# EasyEDA Pro project ProPrj_Desktop_Pet_Dog_V1.3.epro, board PCB
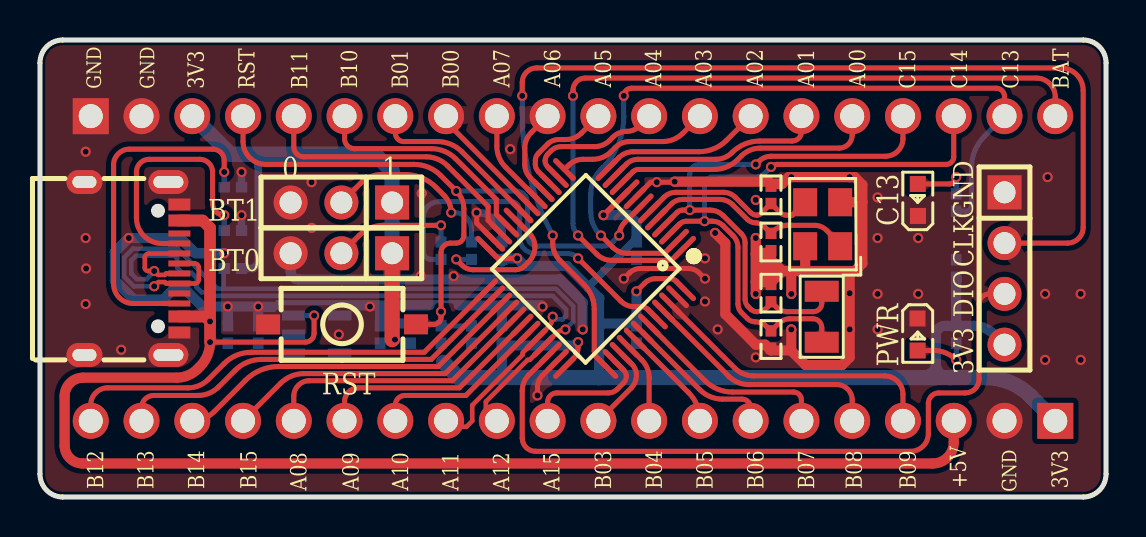
[diagram p3: board, top side]
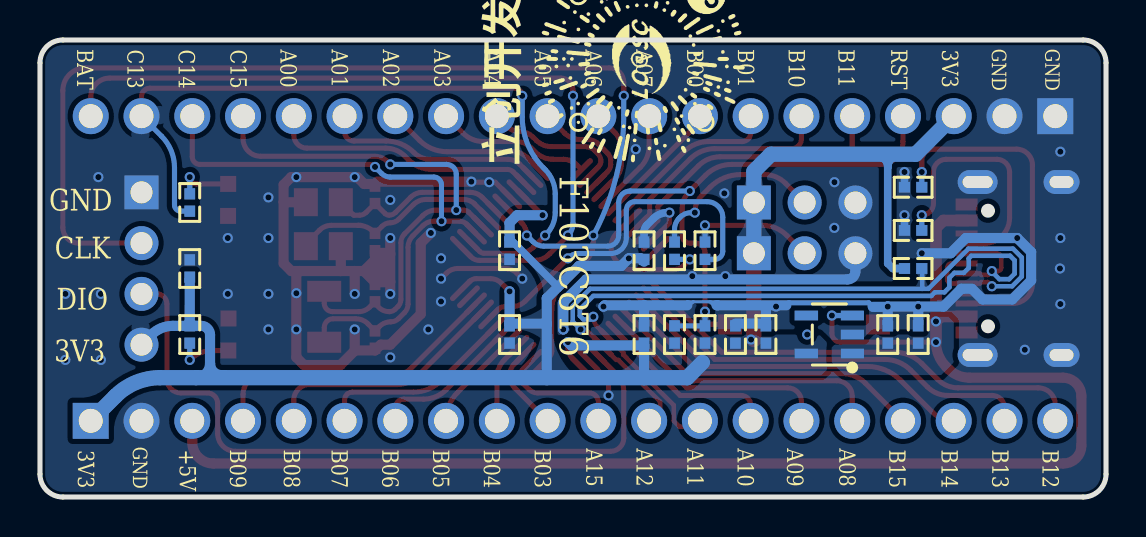
[diagram p4: board, bottom side, seen from below]

Outline 53.34 x 22.86 mm; copper layers: Top Layer, Bottom Layer. Coordinates in mm from the lower left corner of the outline.
Outline path: 0,21.72 0,1.14 arc(0.33,0.33) 1.14,0 52.2,0 arc(53.01,0.33) 53.34,1.14 53.34,21.72 arc(53.01,22.53) 52.2,22.86 1.14,22.86 arc(0.33,22.53) 0,21.72
Stack: Top Layer 0.035mm - / Dielectric1 1.51mm FR4 er 4.5 / Bottom Layer 0.035mm -

## Design rules (mm)
net USB_D-_PA11: DP1
net USB_D+_PA12: DP1
template: 自定义配置
spacing copperThickness1oz (default): track to track 0.102, other pairs 0.152 to 0.3
spacing copperThickness2oz: track to track 0.203, other pairs 0.152 to 0.3
track width copperThickness1oz (default): min 0.152, default 0.254, max 2.54
track width copperThickness2oz: min 0.152, default 0.254, max 2.54
differential pair differentialPair (default): width min 0.229, default 0.229, max 0.229; gap min 0.127, default 0.127
via viaSize (default): diameter min 0.508, default 0.508, max 0.508; hole min 0.305, default 0.305, max 0.305

## Placement (name value [footprint] x y rotation side)
C15  100nF  [R0402]  10.92 8.13 270 bottom
C16  100nF  [R0402]  17.02 8.13 270 bottom
C17  100nF  [R0402]  21.59 8.13 90 bottom
C18  100nF  [R0402]  23.11 8.13 270 bottom
C19  100nF  [R0402]  23.11 12.32 270 bottom
C20  100nF  [R0402]  29.84 12.32 90 bottom
C21  100nF  [R0402]  29.84 8.13 90 bottom
C22  100nF  [R0402]  45.85 11.43 270 bottom
C23  1uF  [R0402]  9.4 8.13 270 bottom
C24  1uF  [R0402]  18.54 8.13 270 bottom
C27  12pF  [R0402]  36.58 7.88 90 top
C28  12pF  [R0402]  36.58 10.2 270 top
C33  12pF  [R0402]  36.58 15.11 270 top
C34  12pF  [R0402]  36.58 12.75 270 top
H1  YZT1070-06104-04025-01  [HDR-TH_4P-P2.54-V-M]  48.26 11.43 270 top
H2  -  [HDR-TH_20P-P2.54-V-M-1]  26.67 19.05 0 top
H3  -  [HDR-TH_3P-P2.54-V-M]  15.08 12.19 180 top
H4  -  [HDR-TH_3P-P2.54-V-M]  15.08 14.73 180 top
H5  -  [HDR-TH_20P-P2.54-V-M-1]  26.67 3.81 180 top
LDO1  ME6211C33M5G-N  [SOT-23-5_L3.0-W1.7-P0.95-LS2.8-BL]  13.84 8.13 90 bottom
LED1  -  [LED_0603]  43.92 8.08 270 top
LED2  -  [LED_0603]  43.92 14.91 90 top
R9  5.1kΩ  [R0402]  9.65 15.49 0 bottom
R10  5.1kΩ  [R0402]  9.65 13.33 0 bottom
R11  1.5kΩ  [R0402]  9.65 11.43 0 bottom
R12  1kΩ  [R0402]  45.85 8.13 90 bottom
R13  1kΩ  [R0402]  45.85 14.73 270 bottom
R14  10kΩ  [R0402]  20.07 8.13 270 bottom
R15  10kΩ  [R0402]  21.59 12.32 90 bottom
R16  10kΩ  [R0402]  20.07 12.32 270 bottom
SW1  TS-1101-B-W  [KEY-SMD_2P-L6.0-W3.6-P7.4-LS8.0-L]  15.11 8.64 0 top
U1  STM32F103C8T6  [LQFP-48_L7.0-W7.0-P0.50-LS9.0-BL]  27.31 11.43 135 top
USB1  TYPE-C 16PIN 2MD(073)  [USB-C-SMD_TYPE-C-6PIN-2MD-073]  4.6 11.43 270 top
X3  8MHz  [CRYSTAL-SMD_4P-L3.2-W2.5-BL-1]  39.16 13.64 90 top
X5  32.768kHz  [OSC-SMD_L3.2-W1.5]  39.12 9.02 90 top

## Footprints (pads in the part's own frame, mm; a bottom-side part is the same pattern mirrored in y, then rotated)
CRYSTAL-SMD_4P-L3.2-W2.5-BL-1
  rect 1.4x1.2 smd: 1(-1.1,-0.875) 2(1.1,-0.875) 3(1.1,0.875) 4(-1.1,0.875)
HDR-TH_3P-P2.54-V-M
  rect 1.7x1.7 hole 1.1: 1(-2.54,0)
  round 1.7 hole 1.1: 2(0,0) 3(2.54,0)
HDR-TH_4P-P2.54-V-M
  rect 1.7x1.7 hole 1.1: 1(-3.81,0)
  round 1.7 hole 1.1: 2(-1.27,0) 3(1.27,0) 4(3.81,0)
HDR-TH_20P-P2.54-V-M-1
  rect 1.8x1.8 hole 1.2: 1(-24.13,0)
  round 1.8 hole 1.2: 2(-21.59,0) 3(-19.05,0) 4(-16.51,0) 5(-13.97,0) 6(-11.43,0) 7(-8.89,0) 8(-6.35,0) 9(-3.81,0) 10(-1.27,0) 11(1.27,0) 12(3.81,0) 13(6.35,0) 14(8.89,0) 15(11.43,0) 16(13.97,0) 17(16.51,0) 18(19.05,0) 19(21.59,0) 20(24.13,0)
KEY-SMD_2P-L6.0-W3.6-P7.4-LS8.0-L
  rect 1.2x1 smd: 1(-3.7,0) 2(3.7,0)
LED_0603
  rect 0.8x0.8 smd: 1(-0.851,-0.01) 2(0.75,-0.005)
LQFP-48_L7.0-W7.0-P0.50-LS9.0-BL
  oval 0.27x1.5 smd: 1(-2.75,-4.25) 2(-2.25,-4.25) 3(-1.75,-4.25) 4(-1.25,-4.25) 5(-0.75,-4.25) 6(-0.25,-4.25) 7(0.25,-4.25) 8(0.75,-4.25) 9(1.25,-4.25) 10(1.75,-4.25) 11(2.25,-4.25) 12(2.75,-4.25) 25(2.75,4.25) 26(2.25,4.25) 27(1.75,4.25) 28(1.25,4.25) 29(0.75,4.25) 30(0.25,4.25) 31(-0.25,4.25) 32(-0.75,4.25) 33(-1.25,4.25) 34(-1.75,4.25) 35(-2.25,4.25) 36(-2.75,4.25)
  oval 1.5x0.27 smd: 13(4.25,-2.75) 14(4.25,-2.25) 15(4.25,-1.75) 16(4.25,-1.25) 17(4.25,-0.75) 18(4.25,-0.25) 19(4.25,0.25) 20(4.25,0.75) 21(4.25,1.25) 22(4.25,1.75) 23(4.25,2.25) 24(4.25,2.75) 37(-4.25,2.75) 38(-4.25,2.25) 39(-4.25,1.75) 40(-4.25,1.25) 41(-4.25,0.75) 42(-4.25,0.25) 43(-4.25,-0.25) 44(-4.25,-0.75) 45(-4.25,-1.25) 46(-4.25,-1.75) 47(-4.25,-2.25) 48(-4.25,-2.75)
OSC-SMD_L3.2-W1.5
  rect 1.05x1.7 smd: 1(-1.275,0) 2(1.275,0)
R0402
  rect 0.566x0.54 smd: 1(-0.433,0) 2(0.433,0)
SOT-23-5_L3.0-W1.7-P0.95-LS2.8-BL
  rect 0.49x1.157 smd: 1(-0.95,-1.153) 2(0,-1.153) 3(0.95,-1.153)
  rect 0.49x1.175 smd: 4(0.95,1.153) 5(-0.95,1.153)
USB-C-SMD_TYPE-C-6PIN-2MD-073
  rect 0.6x1.1 smd: 1(-3.2,2.375) 2(-2.4,2.375) 11(2.4,2.375) 12(3.2,2.375)
  rect 0.3x1.1 smd: 3(-1.75,2.375) 4(-1.25,2.375) 5(-0.75,2.375) 6(-0.25,2.375) 7(0.25,2.375) 8(0.75,2.375) 9(1.25,2.375) 10(1.75,2.375)
  oval 1.2x2 hole 0.6x1.5: 13(-4.325,1.825) 14(4.325,1.825)
  oval 1.2x1.8 hole 0.6x1.2: 13(-4.325,-2.375) 14(4.325,-2.375)

## Nets
As in the schematic.

Pads without a net: LDO1 4; USB1 3 9

## Via types
v1: diameter 0.508, hole 0.305, Top Layer to Bottom Layer, 85 vias

## Routing (per net, layer and track width the routed paths; a pad name or vN(x,y) marks a point on that pad's centre or on a via; arc(x,y) is an arc through that point)
3V3: length 102.9
  Top Layer w0.254: U1.48 31.83,10.79 arc(31.69,10.89) 31.52,10.92 30.8,10.92 arc(30.5,10.86) 30.26,10.7 v1(29.84,10.29) ; v1(26.92,7.75) 26.92,7.48 arc(26.87,7.18) 26.7,6.94 U1.36 ; v1(23.88,11.94) 22.91,11.94 U1.24
  Top Layer w0.28: v1(28.19,14.1) 28.2,14.1 U1.9
  Top Layer w0.762: H3.1 17.62,7.87
  Bottom Layer w0.381: 27.43,10.5 27.43,10.52 29.78,12.86 29.84,12.86 ; 10.92,16.64 10.92,17.02 ; 10.92,16.64 10.92,16.51 ; 10.92,16.64 arc(10.81,16.91) 10.54,17.02 ; 10.92,16.51 10.92,11.68 10.67,11.43 10.09,11.43 ; 10.92,16.51 arc(10.77,16.87) 10.41,17.02 ; 10.92,16.51 arc(11.07,16.87) 11.43,17.02
  Bottom Layer w0.508: R12.2 45.28,8.56 arc(44.96,8.43) 44.83,8.11 44.83,6.67 ; R12.2 45.85,10.89 ; R12.2 46.7,8.56 arc(47.27,8.45) 47.76,8.12 H1.4 ; 44.83,6.67 44.83,6.1 ; 44.83,6.67 arc(44.66,6.26) 44.26,6.1 44.07,6.1 ; 44.83,6.67 arc(45.04,6.17) 45.53,5.97 ; 27.98,8.67 27.98,9.95 26.37,11.56 24.26,11.56 v1(23.88,11.94) 23.28,11.94 23.11,11.77 ; 27.98,8.67 27.99,8.67 29.84,8.67 v1(29.84,10.29) ; 27.98,8.67 27.98,5.97 ; v1(28.19,14.1) 29.46,14.1 29.84,13.72 29.84,12.86 ; 23.11,5.97 23.11,7.58 26.76,7.58 v1(26.92,7.75)
  Bottom Layer w0.762: 20.19,6.73 20.96,5.97 47.34,5.97 arc(48.54,5.73) 49.56,5.05 H5.1 ; H3.1 H4.1 17.62,16.29 16.76,17.14 9.53,17.14 H2.3
  vias: v1(17.76,7.87)
+5V: length 74.4
  Top Layer w0.254: v1(8.51,7.75) 13.27,7.75 arc(13.59,7.88) 13.72,8.19 v1(13.72,9.08)
  Top Layer w0.508: H5.3 45.72,2.73 arc(45.41,1.99) 44.67,1.68 2.13,1.68 arc(1.5,1.94) 1.23,2.58 1.23,5.04 arc(1.5,5.7) 2.16,5.97 6.84,5.97 arc(7.4,6.08) 7.88,6.4 8,6.52 arc(8.38,7.08) v1(8.51,7.75)
  Top Layer w0.584: USB1.2 8.14,13.83 8.51,13.46 v1(8.51,8.78) ; v1(8.51,8.78) v1(8.51,7.75) ; v1(8.51,8.78) 8.26,9.03 USB1.11
  Bottom Layer w0.254: LDO1.3 v1(13.72,9.08) 13.72,9.02
GND: length 115.3
  Top Layer w0.254: v1(21.85,14.22) 21.85,13.71 U1.23 ; v1(24.89,5.08) 24.89,5.49 arc(24.96,5.81) 25.14,6.08 25.89,6.83 ; U1.8 30.56,15.75 v1(30.86,15.75) 31.73,15.75 v1(31.76,15.77) ; v1(29.21,10.92) 29.48,11.2 arc(29.74,11.37) 30.05,11.43 32.45,11.43 arc(32.74,11.37) 32.99,11.2 v1(33.27,10.92)
  Top Layer w0.508: 38.3,11.3 40.36,11.3 ; 38.3,11.3 37.6,11.3 ; 38.3,11.3 arc(38.29,11.32) 38.29,11.34 X3.4 ; 40.36,11.3 40.77,11.3 41.15,11.68 41.15,14.75 ; 40.36,11.3 40.51,11.15 v1(40.51,10.19) v1(40.51,8.39) 40.51,6.98 40.13,6.6 38.3,6.6 37.58,7.33 ; 41.15,14.75 41.15,15.62 40.77,16 v1(40.51,16) 37.47,16 37.12,15.66 36.58,15.66 36.46,15.77 v1(31.76,15.77) ; 41.15,14.75 arc(41.14,14.75) 41.13,14.74 X3.2 ; 37.6,11.3 37.13,11.3 ; 37.6,11.3 37.59,11.3 v1(37.59,10.16) ; v1(35.81,10.16) 35.81,10.76 ; 35.81,10.76 35.81,12.15 ; 35.81,10.76 35.83,10.74 36.58,10.74 ; 37.58,7.33 37.59,7.35 v1(37.59,8.38) ; 37.58,7.33 36.58,7.33 36.29,7.62 35.82,7.62 34.29,9.15 34.29,12.7 v1(33.78,13.21) ; 36.58,11.86 36.58,10.74 ; 36.58,11.86 37.13,11.3 ; 36.58,11.86 36.58,12.21 ; 36.58,10.74 37.13,11.3 ; 36.58,12.21 36.48,12.21 ; 36.58,12.21 C34.2 arc(36.52,12.27) 36.48,12.21 ; 36.48,12.21 35.87,12.21 35.81,12.15 ; 36.48,12.21 arc(36.27,11.83) 36.19,11.4 36.19,11.05 ; 35.81,12.15 v1(35.81,12.95)
  Bottom Layer w0.152: 20.96,9.59 20.96,9.77 20.66,9.77 ; 19.82,9.77 19.43,9.77 19.43,9.59 ; 19.82,9.77 19.65,9.6 ; 19.82,9.77 20.66,9.77 ; 20.66,9.77 20.8,9.62 20.82,9.62
  Bottom Layer w0.254: 16,9.59 15.88,9.72 11.87,9.72 11.56,9.4
  Bottom Layer w0.381: 10.09,15.49 v1(10.09,16.26) ; 10.09,13.33 v1(10.09,14.1) ; 23.11,12.86 23.11,13.28 arc(23.08,13.45) 22.99,13.59 22.64,13.93 arc(22.32,14.15) 21.94,14.22 v1(21.85,14.22)
  Bottom Layer w0.508: 9.4,8.67 v1(9.4,9.53) ; v1(9.4,9.53) v1(10.92,9.53) ; v1(9.4,9.53) 8.13,9.53 7.24,10.41 6.71,10.41 6.18,9.88 4.69,9.88 3.75,10.83 3.75,12.26 v1(4.44,12.95) 7.01,12.95 7.78,12.19 v1(9.22,12.19) ; v1(10.92,9.53) 10.92,8.67 ; v1(10.92,9.53) 10.94,9.51 11.67,9.51 ; 23.11,8.67 23.11,9.58 23.11,9.59 ; 18.54,8.67 17.02,8.67 17.02,9.53 ; v1(25.15,9.53) 25.08,9.59 23.11,9.59 ; 16,9.59 19.49,9.59 ; 23.11,9.59 20.96,9.59 ; v1(27.16,8.38) 27.15,8.39 27.15,9.74 26.01,10.88 12.94,10.88 arc(12.66,11) 12.54,11.29 H3.3
  vias: v1(2.29,17.27) v1(2.29,12.95) v1(2.31,11.43) v1(2.29,9.65) v1(4.06,7.37) v1(13.59,15.75) v1(13.59,13.46) v1(14.95,8.13) v1(16.51,9.53) v1(19.1,15.19) v1(19.05,11.05) v1(20.7,11.05) v1(23.53,17.4) v1(33.27,11.94) v1(33.27,9.78) v1(33.91,8.38) v1(35.81,14.86) v1(35.81,6.98) v1(37.59,16) v1(41.91,14.99) v1(41.91,12.95) v1(41.91,10.16) v1(41.91,8.38) v1(43.94,12.95) v1(43.94,10.16) v1(50.29,10.16) v1(50.29,6.86) v1(50.42,16) v1(52.07,10.16) v1(52.07,6.86)
VBAT: length 39.4
  Top Layer w0.254: U1.1 31.77,12 arc(31.58,11.88) 31.36,11.84 28.61,11.84 arc(28.2,11.92) 27.86,12.15 v1(26.92,13.08) ; v1(26.67,20.07) 26.67,20.35 arc(26.85,20.78) 27.28,20.95 49.85,20.95 arc(50.52,20.68) 50.8,20.01 H2.20
  Bottom Layer w0.254: v1(26.67,20.07) 26.67,13.69 arc(26.74,13.36) v1(26.92,13.08)
BOOT0: length 18.3
  Top Layer w0.254: v1(26.92,11.94) 29.07,9.8 arc(29.37,9.6) 29.72,9.53 30.06,9.53 arc(30.26,9.49) 30.42,9.38 U1.44
  Bottom Layer w0.254: R16.2 19.58,11.89 arc(19.29,12) 19.18,12.29 19.18,13.99 arc(19.41,14.54) 19.96,14.77 23.58,14.77 arc(23.88,14.65) 24,14.35 24,12.95 arc(24.23,12.41) 24.78,12.18 26.4,12.18 arc(26.66,12.13) 26.88,11.98 v1(26.92,11.94)
BOOT1: length 7.3
  Top Layer w0.254: v1(20.83,11.89) 21.12,11.6 arc(21.37,11.43) 21.67,11.37 23.8,11.37 arc(24.04,11.42) 24.25,11.56 24.45,11.76 arc(24.68,12.11) 24.76,12.52 arc(24.69,12.88) 24.49,13.18 U1.20
  Bottom Layer w0.254: R15.1 v1(20.83,11.89)
NRST: length 36.6
  Top Layer w0.254: U1.7 29.25,13.73 arc(29.05,13.43) v1(28.98,13.08) ; H2.4 10.16,17.78 arc(10.49,16.97) 11.3,16.64 18.72,16.64 arc(19.44,16.49) 20.04,16.09 v1(20.83,15.31) 20.85,15.29 arc(21.11,14.89) 21.21,14.41 21.21,13.08 arc(21.1,12.81) 20.83,12.7 20.54,12.7 arc(20.2,12.56) 20.07,12.23 v1(20.07,9.27) 20.07,8.99 arc(19.96,8.74) 19.71,8.64 SW1.2
  Bottom Layer w0.254: 21.59,8.67 21.48,8.56 R14.1 v1(20.07,9.27) ; v1(28.98,13.08) 28.67,12.77 arc(28.42,12.6) 28.14,12.55 24.93,12.55 arc(24.54,12.71) 24.38,13.09 24.38,14.73 arc(24.22,15.14) 23.81,15.31 v1(20.83,15.31)
OSC32_IN: length 30.1
  Top Layer w0.254: H2.18 45.72,17.02 arc(45.61,16.75) 45.34,16.64 36.88,16.64 arc(36.72,16.6) v1(36.58,16.51) ; U1.3 32.01,13.66 arc(32.16,13.76) 32.34,13.79 v1(33.25,13.79) 33.63,13.79 arc(33.93,13.73) 34.19,13.56 34.68,13.07 arc(34.86,12.8) 34.93,12.48 34.93,9.65 arc(34.97,9.42) 35.1,9.22 35.4,8.92 arc(35.58,8.81) 35.79,8.76 arc(36.1,8.7) 36.36,8.53 36.58,8.31 36.93,8.66 arc(37.21,8.85) 37.54,8.92 38.68,8.92 arc(38.99,8.79) 39.12,8.48 X5.1
  Bottom Layer w0.254: v1(33.25,13.79) 33.25,15.62 arc(33.36,15.89) 33.63,16 35.8,16 arc(36.05,16.05) 36.25,16.19 v1(36.58,16.51)
OSC32_OUT: length 27.9
  Top Layer w0.254: H2.17 43.18,17.93 arc(42.92,17.3) 42.29,17.04 36.58,17.04 arc(36.25,16.98) 35.97,16.79 v1(35.81,16.64) ; X5.2 39.12,9.69 arc(38.99,9.39) 38.7,9.27 37.4,9.27 arc(37.1,9.33) 36.84,9.5 C28.2 arc(36.3,9.41) 35.86,9.27 arc(35.7,9.3) 35.56,9.39 35.43,9.53 arc(35.32,9.69) 35.28,9.88 35.28,12.73 arc(35.23,12.96) 35.1,13.16 34.18,14.08 arc(33.88,14.28) 33.52,14.35 v1(32.51,14.35) 32.15,14.35 arc(32.01,14.32) 31.88,14.24 U1.4
  Bottom Layer w0.254: v1(32.51,14.35) 32.51,16.15 arc(32.65,16.49) 33,16.64 v1(35.81,16.64)
OSC_IN: length 10.9
  Top Layer w0.254: U1.5 31.59,14.66 arc(31.84,14.83) 32.14,14.88 34.01,14.88 arc(34.37,14.81) 34.67,14.61 35.39,13.89 arc(35.58,13.76) 35.81,13.72 arc(36.03,13.67) 36.22,13.55 C34.1 36.66,13.27 arc(37.01,13.51) 37.42,13.59 ; 37.42,13.59 38.76,13.59 arc(39.08,13.52) 39.36,13.34 40.04,12.66 X3.1 ; 37.42,13.59 37.27,13.59
OSC_OUT: length 9.3
  Top Layer w0.254: X3.3 37.64,14.1 37.35,14.1 arc(37.17,14.13) 37.02,14.23 C33.2 36.08,14.18 arc(35.98,14.12) 35.88,14.1 arc(35.7,14.13) 35.55,14.23 34.79,14.99 arc(34.52,15.18) 34.19,15.24 31.82,15.24 arc(31.5,15.18) 31.22,14.99 30.49,14.26
PA0: length 13.5
  Top Layer w0.254: U1.10 29.67,16.27 arc(29.8,16.35) 29.95,16.38 33.71,16.38 arc(34.36,16.51) 34.92,16.88 35.09,17.06 arc(35.53,17.35) 36.04,17.45 39.98,17.45 arc(40.45,17.64) 40.64,18.11 H2.16
PA1: length 11
  Top Layer w0.254: U1.11 29.34,16.65 arc(29.61,16.83) 29.92,16.89 33.81,16.89 arc(34.25,16.98) 34.63,17.23 arc(35.27,17.66) 36.02,17.81 37.63,17.81 arc(37.96,17.94) 38.1,18.27 H2.15
PA2: length 8.2
  Top Layer w0.254: U1.12 28.95,16.97 arc(29.29,17.19) 29.69,17.27 32.98,17.27 arc(33.72,17.42) 34.35,17.84 H2.14
PA3: length 7.7
  Top Layer w0.254: U1.13 26.47,16.61 arc(26.79,16.82) 27.16,16.89 27.65,16.89 arc(28.15,16.99) 28.58,17.28 28.79,17.48 arc(29.12,17.7) 29.5,17.78 31.16,17.78 arc(31.71,17.89) 32.17,18.2 H2.13
PA4: length 7.1
  Top Layer w0.254: 25.89,16.03 25.39,16.52 arc(25.3,16.66) 25.27,16.81 arc(25.31,17) 25.42,17.16 25.57,17.31 arc(25.8,17.47) 26.08,17.53 27.74,17.53 arc(28.16,17.61) 28.51,17.84 28.67,18 arc(28.99,18.21) 29.36,18.29 arc(29.69,18.35) 29.97,18.54 H2.12
PA5: length 5.5
  Top Layer w0.254: H2.11 27.09,18.2 arc(26.74,17.97) 26.32,17.88 25.95,17.88 arc(25.69,17.84) 25.46,17.7 arc(25.43,17.68) 25.4,17.65 24.93,17.19 arc(24.82,17.02) 24.78,16.83 24.78,16.64 arc(24.82,16.44) 24.94,16.27 U1.15
PA6: length 4.5
  Top Layer w0.254: U1.16 24.53,15.98 arc(24.33,16.27) 24.26,16.63 24.26,17.45 arc(24.34,17.87) 24.58,18.23 H2.10
PA7: length 4.8
  Top Layer w0.254: H2.9 22.86,17.55 arc(22.97,16.98) 23.3,16.5 U1.17
PA8: length 14
  Top Layer w0.254: U1.29 20.63,5.82 13.47,5.82 arc(12.93,5.59) 12.7,5.04 H5.16
PA9/USART1_TX: length 11.5
  Top Layer w0.254: U1.30 20.98,5.46 15.93,5.46 arc(15.44,5.26) 15.24,4.77 H5.15
PA10/USART1_RX: length 9.1
  Top Layer w0.254: U1.31 21.31,5.08 18.26,5.08 arc(17.92,4.94) 17.78,4.6 H5.14
PA13/SWDIO: length 36
  Top Layer w0.254: H1.3 47.49,10.16 arc(47.14,10.01) 46.99,9.66 46.99,5.9 arc(46.79,5.41) 46.29,5.21 44.98,5.21 arc(44.6,5.05) 44.45,4.68 44.45,3.17 arc(44.19,2.55) 43.56,2.29 24.79,2.29 arc(24.32,2.48) 24.13,2.95 24.13,5.31 arc(24.22,5.74) 24.46,6.11 U1.34
PA14/SWCLK: length 55.8
  Top Layer w0.254: v1(24.13,20.07) 24.13,20.74 arc(24.34,21.25) 24.85,21.46 51.06,21.46 arc(51.87,21.13) 52.2,20.33 52.2,13.49 arc(51.97,12.93) 51.41,12.7 H1.2 ; v1(25.65,13.08) 25.65,12.7 arc(25.75,12.23) 26.01,11.83 27.23,10.62 arc(27.5,10.27) 27.67,9.86 arc(27.7,9.75) 27.72,9.64 arc(27.73,9.52) 27.73,9.4 27.73,7.3 arc(27.77,7.13) 27.86,6.98 U1.37
  Bottom Layer w0.254: v1(24.13,20.07) 24.13,19.1 arc(24.17,18.09) 24.29,17.08 arc(24.8,15.03) v1(25.65,13.08)
PA15: length 6.6
  Top Layer w0.254: U1.38 29.21,6.34 arc(29.31,6.2) 29.34,6.04 arc(29.3,5.86) 29.19,5.7 28.89,5.39 arc(28.68,5.26) 28.44,5.21 25.86,5.21 arc(25.54,5.07) 25.4,4.74 H5.11
PB0: length 6.1
  Top Layer w0.254: U1.18 20.52,18.57 arc(20.37,18.79) H2.8
PB1: length 8.8
  Top Layer w0.254: U1.19 21.11,17.27 arc(20.55,17.65) 19.88,17.78 18.2,17.78 arc(17.9,17.9) 17.78,18.2 H2.7
PB3: length 4.4
  Top Layer w0.254: U1.39 29.62,6.64 arc(29.79,6.39) 29.84,6.09 arc(29.78,5.74) 29.58,5.45 H5.10
PB4: length 4.1
  Top Layer w0.254: U1.40 30.11,6.86 arc(30.38,6.45) 30.48,5.96 H5.9
PB5: length 5.3
  Top Layer w0.254: H5.8 33.02,3.86 arc(32.87,4.59) 32.46,5.22 U1.41
PB6: length 7.6
  Top Layer w0.254: U1.42 33.01,5.37 arc(33.54,5.02) 34.16,4.89 35.13,4.89 arc(35.43,4.77) 35.56,4.47 H5.7
PB7: length 10.2
  Top Layer w0.254: H5.6 38.1,4.86 arc(37.98,5.14) 37.71,5.25 34.65,5.25 arc(33.9,5.4) 33.26,5.82 30.49,8.6
PB8: length 12.4
  Top Layer w0.254: H5.5 40.64,4.85 arc(40.41,5.4) 39.86,5.62 35.47,5.62 arc(34.92,5.73) 34.46,6.04 U1.45
PB9: length 14.9
  Top Layer w0.254: H5.4 43.18,5.13 arc(42.91,5.79) 42.25,6.06 35.72,6.06 arc(35.19,6.16) 34.75,6.46 U1.46
PB10: length 11.6
  Top Layer w0.254: U1.21 22.83,14.13 22.83,14.89 20.8,16.92 arc(20.24,17.29) 19.57,17.42 15.74,17.42 arc(15.39,17.57) 15.24,17.92 H2.6
PB11: length 14.1
  Top Layer w0.254: U1.22 22.42,13.84 22.42,14.53 20.38,16.57 arc(19.89,16.9) 19.31,17.02 13.19,17.02 arc(12.84,17.16) 12.7,17.51 H2.5
PB12: length 23
  Top Layer w0.254: H5.20 2.54,4.61 arc(2.79,5.21) 3.39,5.46 7.41,5.46 arc(7.96,5.57) 8.42,5.88 9.21,6.67 arc(9.84,7.09) 10.58,7.24 19.22,7.24 U1.25
PB13: length 20.5
  Top Layer w0.254: U1.26 19.58,6.88 11.08,6.88 arc(10.37,6.74) 9.77,6.34 8.93,5.5 arc(8.46,5.19) 7.91,5.08 5.69,5.08 arc(5.26,4.9) 5.08,4.47 H5.19
PB14: length 17.7
  Top Layer w0.254: U1.27 19.93,6.53 11.94,6.53 arc(11.05,6.35) 10.29,5.85 8.7,4.26 arc(8.21,3.93) H5.18
PB15: length 15.5
  Top Layer w0.254: U1.28 20.28,6.17 13.21,6.17 arc(12.57,6.05) 12.04,5.69 H5.17
PC13: length 38.5
  Top Layer w0.254: v1(28.07,13.08) 28.66,12.49 arc(28.99,12.27) 29.38,12.19 31.12,12.19 arc(31.24,12.22) 31.34,12.28 31.9,12.84 ; H2.19 48.26,20.04 arc(48.14,20.33) 47.85,20.45 29.59,20.45 arc(29.32,20.34) v1(29.21,20.07)
  Bottom Layer w0.254: 45.85,14.3 46.3,14.3 arc(46.52,14.39) 46.61,14.61 46.61,16.48 arc(46.78,17.33) 47.26,18.05 H2.19 ; v1(29.21,20.07) 29.21,19.01 arc(29.06,17.97) 28.6,17.02 arc(28.4,16.74) 28.16,16.47 28.07,16.38 arc(27.69,15.82) 27.56,15.16 27.56,14.23 arc(27.68,13.64) 28.01,13.13 v1(28.07,13.08)
USB_D+_PA12: length 39.6
  Top Layer w0.229: USB1.6 7.73,11.68 arc(7.89,11.62) 7.95,11.47 7.95,10.88 arc(7.89,10.74) 7.74,10.68 USB1.8 6.31,10.68 6.24,10.75 5.93,10.75 v1(5.72,10.54) ; H5.12 22.85,3.81 22.31,4.35 22.31,4.77 24.4,6.86 24.5,6.86 U1.33 25.84,8.19 arc(26.04,8.33) v1(26.29,8.38)
  Bottom Layer w0.229: v1(26.29,8.38) 26.68,8.78 26.68,9.55 25.81,10.41 9.2,10.41 ; 9.2,10.41 8.89,10.41 6.88,12.42 4.65,12.42 4.22,11.98 4.22,11.02 4.7,10.54 v1(5.72,10.54) ; 9.2,10.41 9.2,11.41 R11.1
USB_D-_PA11: length 39.4
  Top Layer w0.229: USB1.7 6.31,11.18 6.24,11.11 5.91,11.11 v1(5.72,11.3) 5.41,11.3 arc(5.29,11.35) 5.24,11.47 5.24,11.97 arc(5.31,12.12) 5.46,12.18 USB1.5 ; H5.13 20.62,3.51 21.34,3.51 21.63,3.8 21.63,4.59 24.16,7.12 24.16,7.22 U1.32 25.44,8.51 arc(25.6,8.74) v1(25.65,9.02)
  Bottom Layer w0.229: v1(25.65,9.02) 25.79,8.88 26.15,8.88 26.33,9.06 26.33,9.39 25.65,10.06 8.74,10.06 8.56,10.24 8.09,10.24 7.84,10.49 7.84,10.96 7.59,11.21 7.12,11.21 6.87,11.46 6.87,11.93 6.74,12.06 4.8,12.06 4.57,11.84 4.57,11.17 4.85,10.9 5.33,10.9 5.72,11.28 v1(5.72,11.3)
$1N2054: length 17.4
  Top Layer w0.254: USB1.10 4.67,9.68 arc(3.97,9.97) 3.68,10.67 3.68,16.61 arc(3.91,17.17) 4.47,17.4 8.65,17.4 arc(9.05,17.23) 9.22,16.83 v1(9.22,16.26)
  Bottom Layer w0.254: R9.1 v1(9.22,16.26)
$1N2066: length 13
  Top Layer w0.254: USB1.4 6.12,12.68 arc(5.2,13.06) 4.83,13.97 4.83,16.26 arc(5.01,16.71) 5.46,16.89 8,16.89 arc(8.45,16.71) 8.64,16.26 8.64,14.68 arc(8.81,14.27) v1(9.22,14.1)
  Bottom Layer w0.254: R10.1 v1(9.22,14.1)
$1N2074: length 2.9
  Top Layer w0.254: LED1.2 44.71,7.33 arc(45.33,7.21) v1(45.85,6.86)
  Bottom Layer w0.254: R12.1 v1(45.85,6.86)
$1N2077: length 3
  Top Layer w0.254: LED2.2 45.5,15.66 arc(45.75,15.76) v1(45.85,16)
  Bottom Layer w0.254: R13.1 v1(45.85,16)
$1N3296: length 9.1
  Top Layer w0.254: H4.2 16.04,15.69 arc(16.52,16.02) 17.09,16.13 18.28,16.13 arc(19.11,15.96) 19.81,15.49 20.22,15.09 arc(20.48,14.69) v1(20.57,14.22)
  Bottom Layer w0.254: R15.2 21.59,13.39 arc(21.53,13.69) 21.36,13.94 21.31,14 arc(21.06,14.17) 20.76,14.22 v1(20.57,14.22)
$1N11047: length 6.3
  Top Layer w0.254: H3.2 15.97,13.08 arc(16.53,13.46) 17.19,13.59 v1(20.07,13.59)
  Bottom Layer w0.254: v1(20.07,13.59) R16.1

## Copper pours and planes (outline as drawn; the poured copper is in the pictures)
3V3 on Bottom Layer: 14.35,8.13 13.97,7.75 13.97,6.35 14.22,6.1 20.57,6.1 20.96,6.48 20.96,7.87 20.7,8.13
+5V on Bottom Layer: 9.13,8.13 8.9,8.35 8.9,8.88 8.76,9.02 7.87,9.02 7.62,8.76 7.62,6.73 8.25,6.1 13.09,6.1 13.73,6.74 13.73,7.48 13.59,7.62 12.1,7.62 11.59,8.13
GND on Top Layer: -1,24 54,24 54,-1 -1,-1
GND on Bottom Layer: -1,24 53.75,24 53.75,-1 -1,-1

Small or netless copper shapes (teardrops, artwork), in the pictures only: 106 on Top Layer, 52 on Bottom Layer

## Text on the board
Bottom Silkscreen Layer: GND | 3V3 | RST | B11 | B10 | B01 | B00 | A07 | A06 | A05 | A04 | A03 | A02 | A01 | A00 | C15 | C14 | C13 | BAT | B12 | B13 | B14 | B15 | A08 | A09 | A10 | A11 | A12 | A15 | B03 | B04 | B05 | B06 | B07 | B08 | B09 | +5V | DIO | CLK | F103C8T6
Top Silkscreen Layer: GND | B12 | B13 | 3V3 | B14 | RST | B15 | A08 | B11 | B10 | A09 | B01 | A10 | A11 | B00 | A12 | A07 | A15 | A06 | A05 | B03 | A04 | B04 | A03 | B05 | A02 | B06 | A01 | B07 | B08 | A00 | C15 | B09 | +5V | C14 | C13 | BAT | CLK | DIO | PWR | BT1 | BT0 | 0 | 1
